# Altium schematic sheet AAS_module_MCU-rev1_2.SchDoc: MCU
size A3; Author: Richard Kubíček; DocumentNumber: 2; SheetNumber: 2; SheetTotal: 4; PageSize: A3; DruhPraceRadek1: Diplomová; DruhPraceRadek2: práce
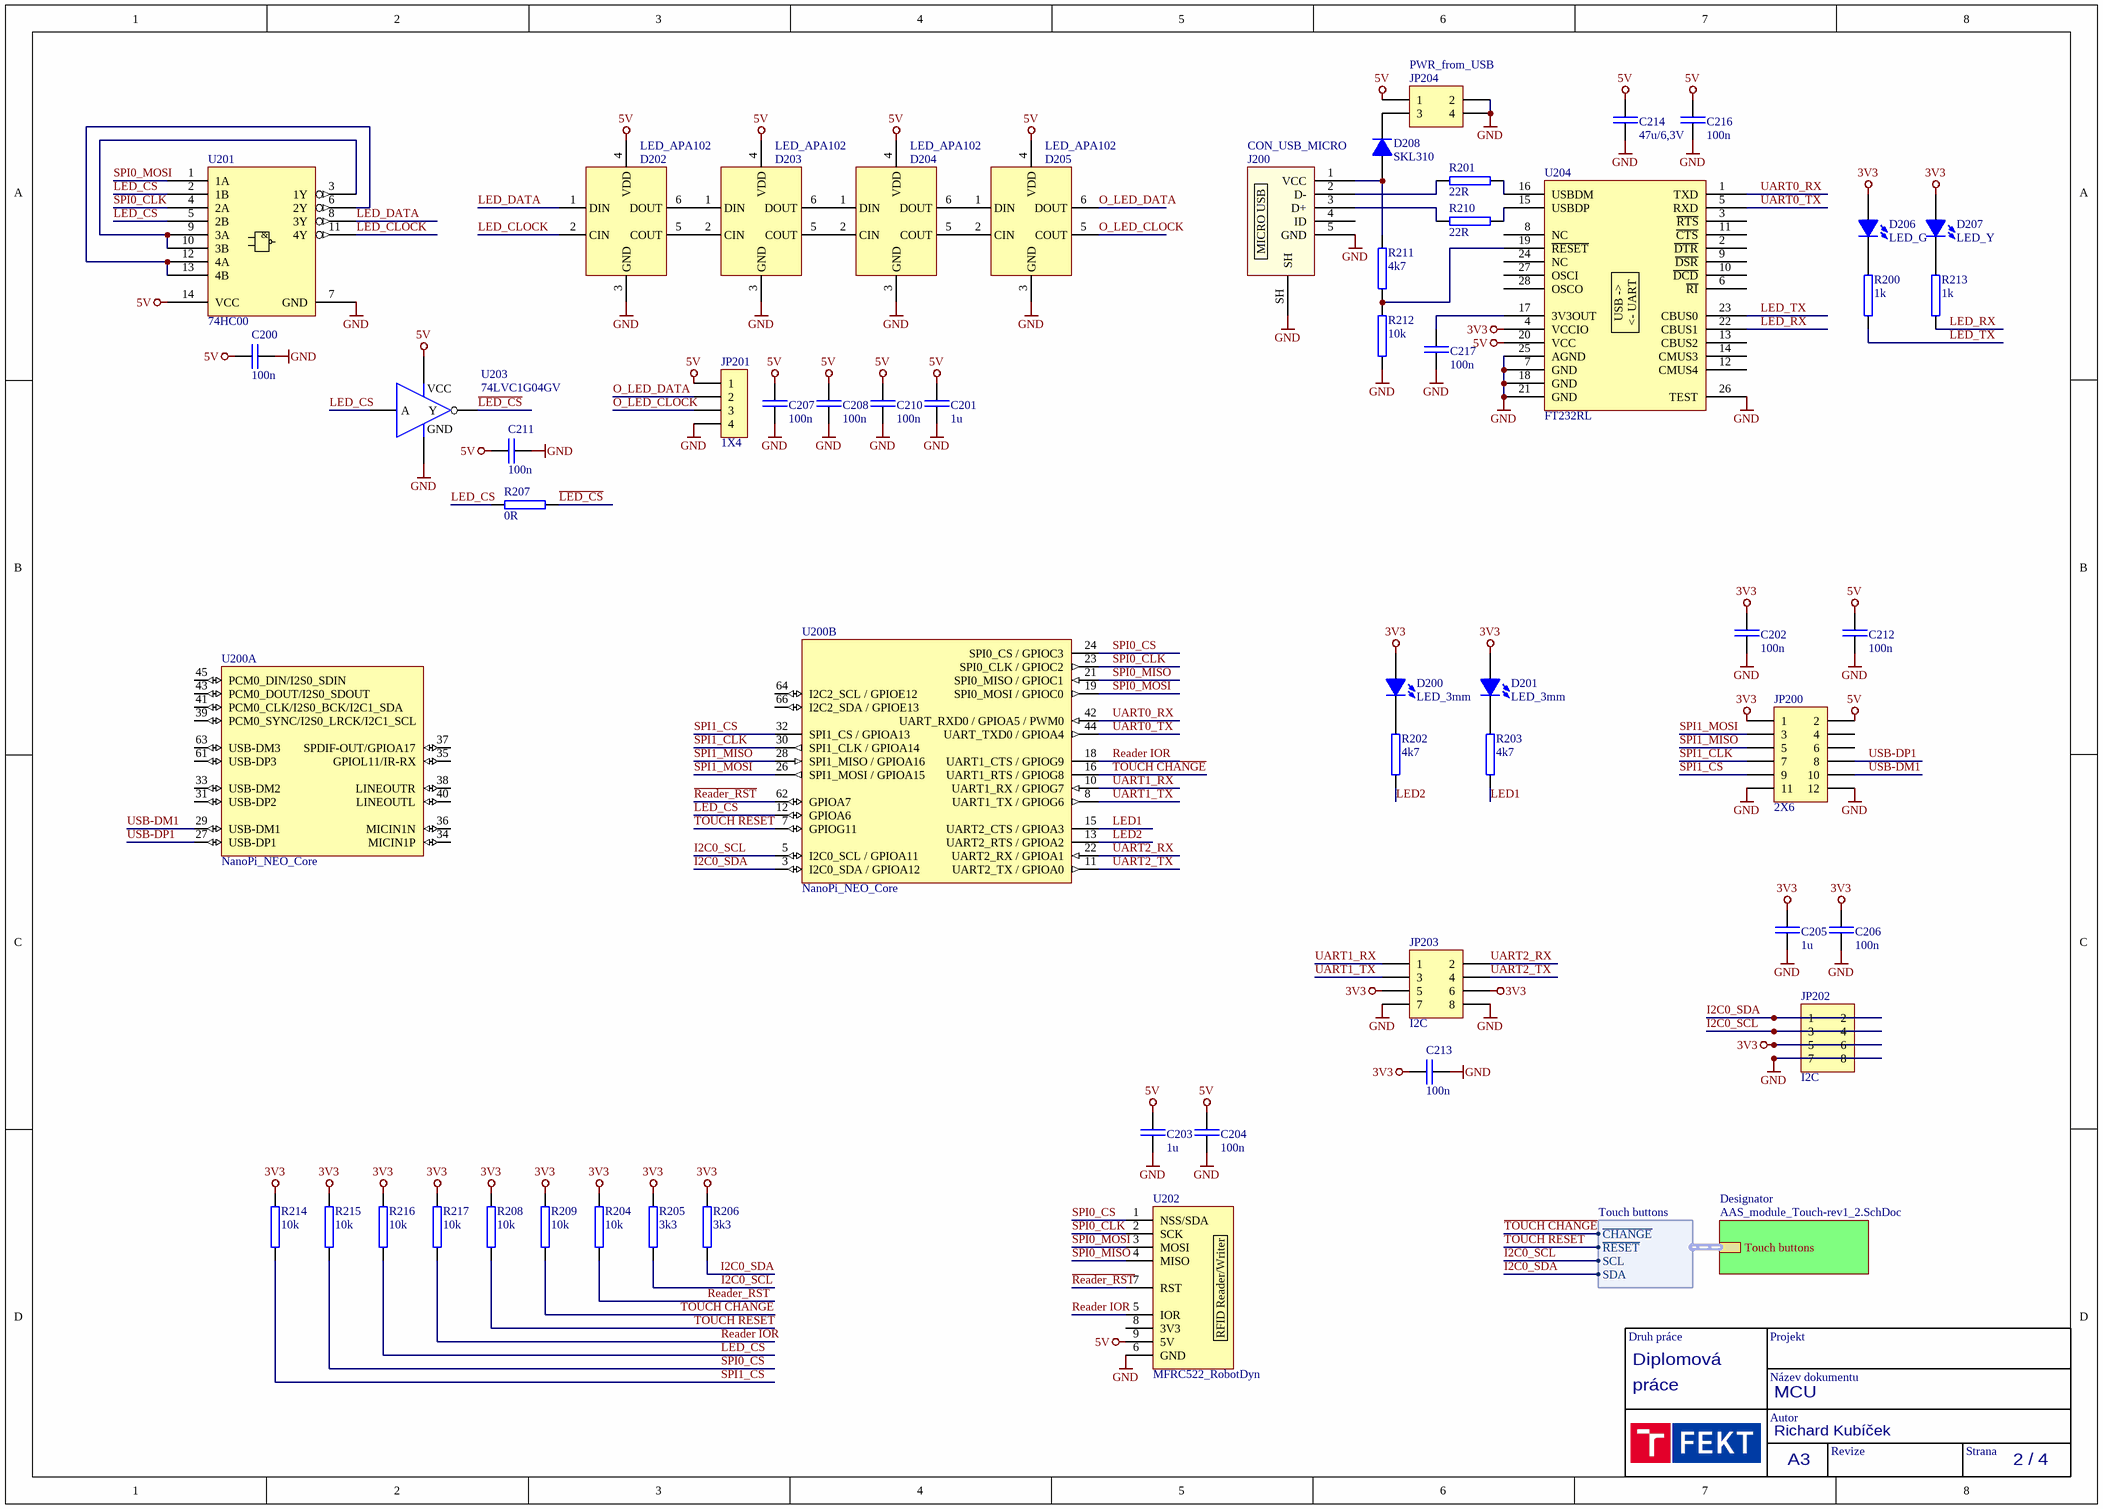
[diagram p0: AAS_module_MCU-rev1_2.SchDoc]

## Parts
C200  100n  [C0603]
C201  1u  [C0603]
C202  100n  [C0603]
C203  1u  [C0603]
C204  100n  [C0603]
C205  1u  [C0603]
C206  100n  [C0603]
C207  100n  [C0603]
C208  100n  [C0603]
C210  100n  [C0603]
C211  100n  [C0603]
C212  100n  [C0603]
C213  100n  [C0603]
C214  47u/6,3V  [C1206]
C216  100n  [C0603]
C217  100n  [C0603]
D200  LED_3mm  [LED_THT_3MM_P2.5_GREEN]
D201  LED_3mm  [LED_THT_3MM_P2.5_GREEN]
D202  LED_APA102  [APA102]
D203  LED_APA102  [APA102]
D204  LED_APA102  [APA102]
D205  LED_APA102  [APA102]
D206  LED_G  [LED_0603]
D207  LED_Y  [LED_0603]
D208  SKL310  [SOD123]
J200  CON_USB_MICRO  [MICRO USB-B SMD]
JP200  2X6  [HDR2x6]
JP201  1X4  [HDR1X4]
JP202  I2C  [HDR2X4]
JP203  I2C  [HDR2X4]
JP204  PWR_from_USB  [HDR2X2A]
R200  1k  [R0603]
R201  22R  [R0603]
R202  4k7  [R0603]
R203  4k7  [R0603]
R204  10k  [R0603]
R205  3k3  [R0603]
R206  3k3  [R0603]
R207  0R  [R0603]
R208  10k  [R0603]
R209  10k  [R0603]
R210  22R  [R0603]
R211  4k7  [R0603]
R212  10k  [R0603]
R213  1k  [R0603]
R214  10k  [R0603]
R215  10k  [R0603]
R216  10k  [R0603]
R217  10k  [R0603]
U200  NanoPi_NEO_Core  [NanoPi_NEO_Core_right]  (parts A,B of 4)
U201  74HC00  [SO-14]
U202  MFRC522_RobotDyn  [MFRC522_RobotDyn]
U203  74LVC1G04GV  [SOT-25]
U204  FT232RL  [SSOP-28]

## Sub-sheets
Designator = AAS_module_Touch-rev1_2.SchDoc: Touch buttons (harness Touch buttons)

## Harnesses
Touch buttons: ~{CHANGE}, ~{RESET}, SCL, SDA

## Nets
3V3: C202.1 C205.1 C206.1 C213.1 D200.A D201.A D206.A D207.A JP200.1 JP202.5 JP202.6 JP203.5 JP203.6 R204.2 R205.2 R206.2 R208.2 R209.2 R214.2 R215.2 R216.2 R217.2 U204.4(VCCIO)
5V: C200.1 C201.1 C203.1 C204.1 C207.1 C208.1 C210.1 C211.1 C212.1 C214.1 C216.2 D202.4(VDD) D203.4(VDD) D204.4(VDD) D205.4(VDD) JP200.2 JP201.1 JP204.1 U201.14(VCC) U202.9(5V) U203.5(VCC) U204.20(VCC)
GND: C200.2 C201.2 C202.2 C203.2 C204.2 C205.2 C206.2 C207.2 C208.2 C210.2 C211.2 C212.2 C213.2 C214.2 C216.1 C217.1 D202.3(GND) D203.3(GND) D204.3(GND) D205.3(GND) J200.5(GND) J200.SH JP200.11 JP200.12 JP201.4 JP202.7 JP202.8 JP203.7 JP203.8 JP204.2 JP204.4 R212.2 U201.7(GND) U202.6(GND) U203.3(GND) U204.7(GND) U204.18(GND) U204.21(GND) U204.25(AGND) U204.26(TEST)
I2C0_SCL: JP202.3 JP202.4 R205.1 U200.5(I2C0_SCL_/_GPIOA11) ; sheet Designator/Touch buttons.SCL
I2C0_SDA: JP202.1 JP202.2 R206.1 U200.3(I2C0_SDA_/_GPIOA12) ; sheet Designator/Touch buttons.SDA
~{LED_CS}: R207.1 U201.2(1B) U201.5(2B) U203.4(Y)
LED1: R203.1 U200.15(UART2_CTS_/_GPIOA3)
LED2: R202.1 U200.13(UART2_RTS_/_GPIOA2)
LED_CLOCK: D202.2(CIN) U201.11(4Y)
LED_CS: R207.2 R216.1 U200.12(GPIOA6) U203.2(A)
LED_DATA: D202.1(DIN) U201.8(3Y)
LED_RX: R213.1 U204.22(CBUS1)
LED_TX: R200.1 U204.23(CBUS0)
O_LED_CLOCK: D205.5(COUT) JP201.3
O_LED_DATA: D205.6(DOUT) JP201.2
~{Reader_RST}: R204.1 U200.62(GPIOA7) U202.7(RST)
Reader IOR: R217.1 U200.18(UART1_CTS_/_GPIOG9) U202.5(IOR)
SPI0_CLK: U200.23(SPI0_CLK_/_GPIOC2) U201.4(2A) U202.2(SCK)
SPI0_CS: R215.1 U200.24(SPI0_CS_/_GPIOC3) U202.1(NSS/SDA)
SPI0_MISO: U200.21(SPI0_MISO_/_GPIOC1) U202.4(MISO)
SPI0_MOSI: U200.19(SPI0_MOSI_/_GPIOC0) U201.1(1A) U202.3(MOSI)
SPI1_CLK: JP200.7 U200.30(SPI1_CLK_/_GPIOA14)
SPI1_CS: JP200.9 R214.1 U200.32(SPI1_CS_/_GPIOA13)
SPI1_MISO: JP200.5 U200.28(SPI1_MISO_/_GPIOA16)
SPI1_MOSI: JP200.3 U200.26(SPI1_MOSI_/_GPIOA15)
~{TOUCH CHANGE}: R209.1 U200.16(UART1_RTS_/_GPIOG8) ; sheet Designator/Touch buttons.~{CHANGE}
~{TOUCH RESET}: R208.1 U200.7(GPIOG11) ; sheet Designator/Touch buttons.~{RESET}
UART0_RX: U200.42(UART_RXD0_/_GPIOA5_/_PWM0) U204.1(TXD)
UART0_TX: U200.44(UART_TXD0_/_GPIOA4) U204.5(RXD)
UART1_RX: JP203.1 U200.10(UART1_RX_/_GPIOG7)
UART1_TX: JP203.3 U200.8(UART1_TX_/_GPIOG6)
UART2_RX: JP203.2 U200.22(UART2_RX_/_GPIOA1)
UART2_TX: JP203.4 U200.11(UART2_TX_/_GPIOA0)
USB-DM1: JP200.10 U200.29(USB-DM1)
USB-DP1: JP200.8 U200.27(USB-DP1)
NetC217_2: C217.2 U204.17(3V3OUT)
NetD200_K: D200.K R202.2
NetD201_K: D201.K R203.2
NetD202_5: D202.5(COUT) D203.2(CIN)
NetD202_6: D202.6(DOUT) D203.1(DIN)
NetD203_5: D203.5(COUT) D204.2(CIN)
NetD203_6: D203.6(DOUT) D204.1(DIN)
NetD204_5: D204.5(COUT) D205.2(CIN)
NetD204_6: D204.6(DOUT) D205.1(DIN)
NetD206_K: D206.K R200.2
NetD207_K: D207.K R213.2
NetD208_A: D208.A J200.1(VCC) R211.1
NetD208_K: D208.K JP204.3
NetJ200_2: J200.2(D-) R201.1
NetJ200_3: J200.3(D+) R210.1
NetR201_2: R201.2 U204.16(USBDM)
NetR210_2: R210.2 U204.15(USBDP)
NetR211_2: R211.2 R212.1 U204.19(~{RESET})
NetU201_3: U201.3(1Y) U201.9(3A) U201.10(3B)
NetU201_6: U201.6(2Y) U201.12(4A) U201.13(4B)

Not connected (* = marked no-connect by the designer): J200 4(ID); JP200 4 6; U200 31(USB-DP2) 33(USB-DM2) 34(MICIN1P) 35(GPIOL11/IR-RX) 36(MICIN1N) 37(SPDIF-OUT/GPIOA17) 38(LINEOUTR) 39(PCM0_SYNC/I2S0_LRCK/I2C1_SCL) 40(LINEOUTL) 41(PCM0_CLK/I2S0_BCK/I2C1_SDA) 43(PCM0_DOUT/I2S0_SDOUT) 45(PCM0_DIN/I2S0_SDIN) 61(USB-DP3) 63(USB-DM3) 64(I2C2_SCL_/_GPIOE12) 66(I2C2_SDA_/_GPIOE13); U202 8(3V3); U203 1(NC); U204 2(~{DTR}) 3(~{RTS}) 6(~{RI}) 8(NC) 9(~{DSR}) 10(~{DCD}) 11(~{CTS}) 12(CMUS4) 13(CBUS2) 14(CMUS3) 24(NC) 27(OSCI) 28(OSCO)

## Notes on the sheet
- Druh práce
- Název dokumentu
- Projekt
- Autor
- Revize
- Strana
- (in symbol 74HC00) &
- (in symbol CON_USB_MICRO) MICRO USB
- (in symbol FT232RL) USB ->; <- UART
- (in symbol MFRC522_RobotDyn) RFID Reader/Writer

## Library data of the parts
C200-C208 C210-C213 C216 C217 = C_0603: Capacitor SMD 0603
C214 = C_1206: Capacitor SMD 1206
D200 D201 = LED_3mm: LED 3mm
D202-D205 = LED_APA102: Intelligent control LED integrated light source
D206 D207 = LED_0603: LED SMD 0603
D208 = 1N4007: Diode
JP200 = Header 2X6: Header, 12-Pin, Dual row
JP201 = Header 1X4: Header, 4-Pin, Single row
JP202 JP203 = Header 2X4: Header, 8-Pin, Dual row
JP204 = Header 2X2: Header, 6-Pin, Dual row
R200-R217 = R_0603: Resistor SMD 0603
U201 = 74HC00: Quad 2-input NAND gate
U203 = 8: Single inverter; ID: 8; ABRA number: 92285; Value: 74LVC1G04GV; Technology: SMT
U204 = FT232RL: USB Interface IC USB to Serial UART Enhanced IC
U202 = MFRC522_RobotDyn: Part Field 2: CORE; Part Field 3: BOTTOM; Part Field 4: AUTOMAT